# Altium project PCB_Project.PrjPcb
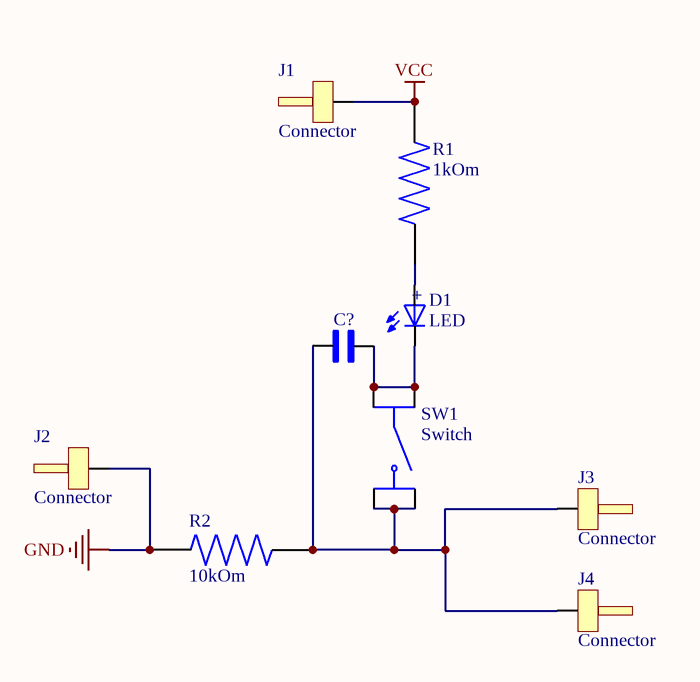
[diagram p0: Button.SchDoc]
1 sheet, 9 parts. Net scope: global (net labels, ports and power ports of the same name join across sheets).
Board file: PCB1.PcbDoc

## Sheet Button.SchDoc
size A4; SheetNumber: 1; SheetTotal: 1

### Parts
C?  C1206C104K2RACTU  [CAPC3216X110N]  (value not drawn)
D1  LED  [WL-SMCW_0805]
J1  Connector  [PCBComponent_1]
J2  Connector  [PCBComponent_1]
J3  Connector  [PCBComponent_1]
J4  Connector  [PCBComponent_1]
R1  1kOm  [RES_ERJU08F2202V]
R2  10kOm  [RESC3015X65N]
SW1  Switch  [SW_EVPBB2A9B000]

### Nets
GND: J2.1 R2.1
VCC: J1.1 R1.2
NetC?_1: C?.1 D1.1(NEG) SW1.A1 SW1.A2
NetC?_2: C?.2 J3.1 J4.1 R2.2 SW1.B1 SW1.B2
NetD1_2: D1.2(POS) R1.1

### Notes on the sheet
- (in symbol WL-SMCW_0805) +

### Library data of the parts
C? = C1206C104K2RACTU: 1206 C 100nF Ceramic Multilayer Capacitor, 200 V, +125degC, X7R Dielec, +/-10% | KEMET C1206C104K2RACTU; SnapEDA_Link: https://www.snapeda.com/parts/C1206C104K2RACTU/KEMET/view-part/?ref=snap; Package: 1206-2 KEMET; Value: *; MF: KEMET; MP: C1206C104K2RACTU; Check_prices: https://www.snapeda.com/parts/C1206C104K2RACTU/KEMET/view-part/?ref=eda
D1 = WL-SMCW_0805: Red 630nm LED Indication - Discrete 1.9V 0805 (2012 Metric); MF: WÃ¼rth Elektronik; MP: 150080SS75000; SnapEDA_Link: https://www.snapeda.com/parts/150080SS75000/W%25C3%25BCrth+Elektronik+Midcom/view-part/?ref=snap; Package: 0805 WÃ¼rth Elektronik; Value: *; Check_prices: https://www.snapeda.com/parts/150080SS75000/W%25C3%25BCrth+Elektronik+Midcom/view-part/?ref=eda
R1 = ERJU08F2202V: Package: None; MP: ERJU08F2202V; Value: *; Price: None; Availability: Unavailable
R2 = CRCW120610K0JNEAC: 10 kOhms Â±5% 0.25W, 1/4W Chip Resistor 1206 (3216 Metric) - Thick Film; MF: Vishay Dale; SnapEDA_Link: https://www.snapeda.com/parts/CRCW120610K0JNEAC/Vishay+Dale/view-part/?ref=snap; Package: 3015 Vishay; Value: *; MP: CRCW120610K0JNEAC; Check_prices: https://www.snapeda.com/parts/CRCW120610K0JNEAC/Vishay+Dale/view-part/?ref=eda
SW1 = EVPBB2A9B000: Tactile Switch SPST-NO Top Actuated Surface Mount; MF: Panasonic; SnapEDA_Link: https://www.snapeda.com/parts/EVPBB2A9B000/Panasonic/view-part/?ref=snap; Package: None; Value: *; MP: EVPBB2A9B000; Check_prices: https://www.snapeda.com/parts/EVPBB2A9B000/Panasonic/view-part/?ref=eda